# EAGLE design six4mix (EAGLE 6.6.0)
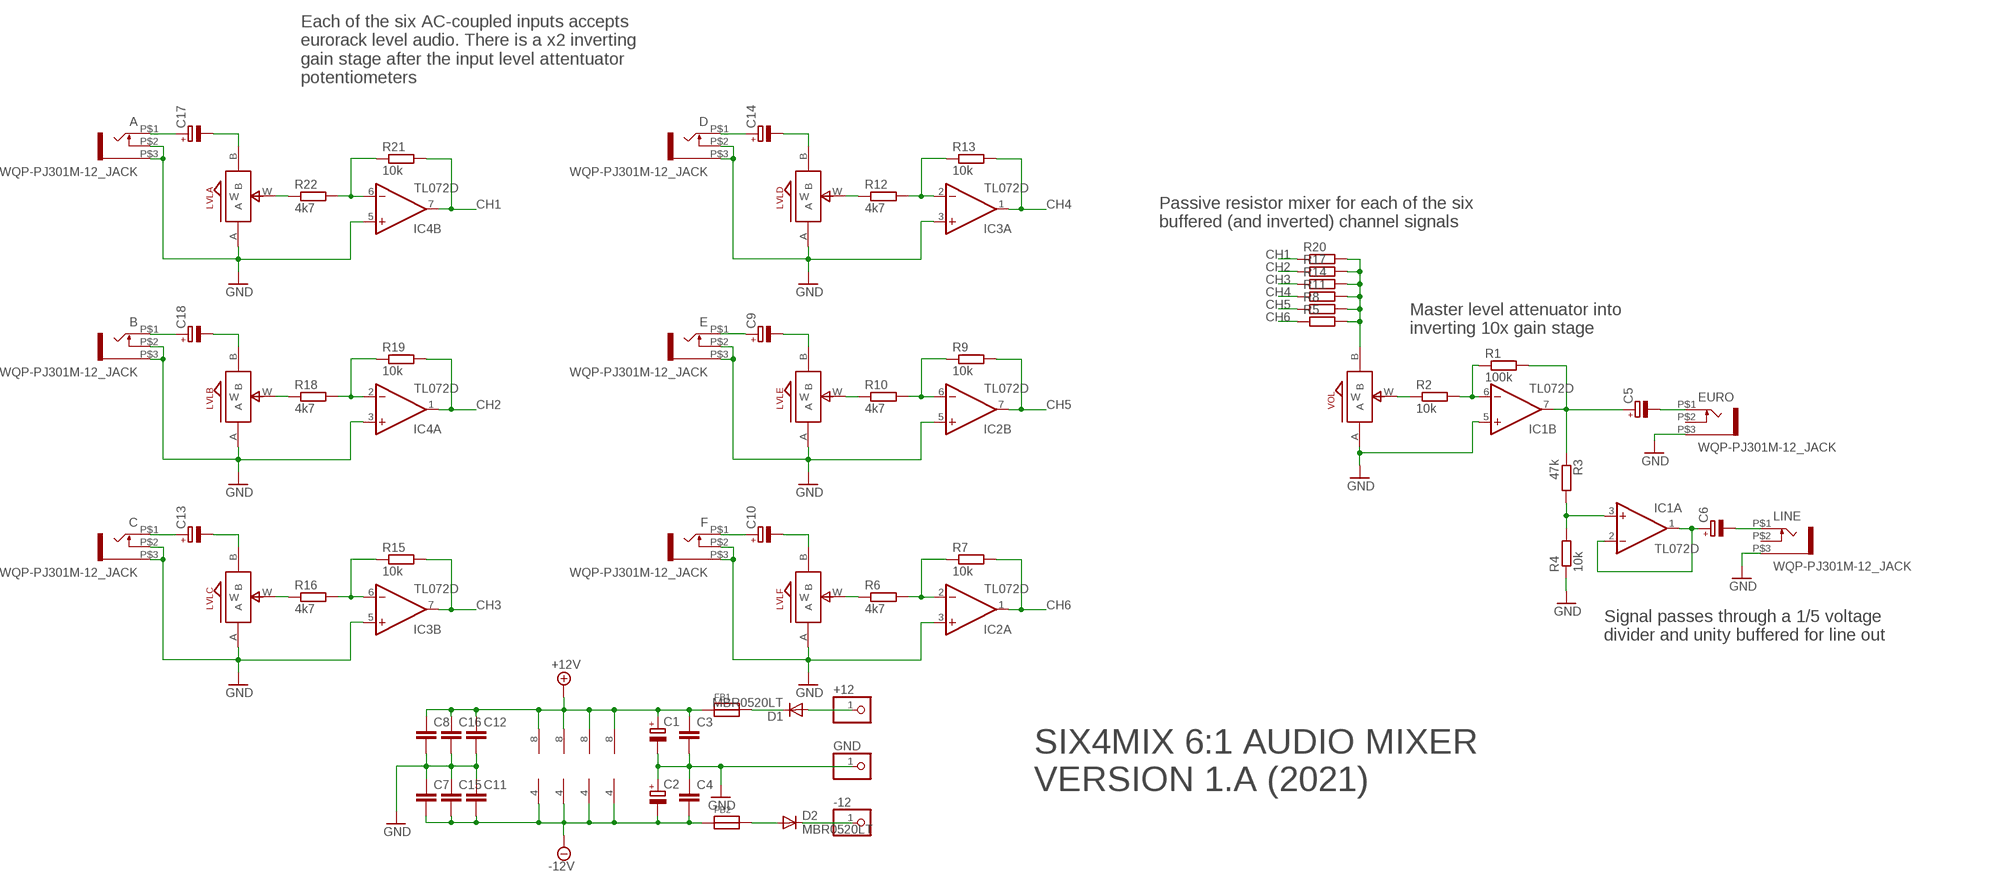
[diagram p0: schematic, sheet 1]

## Parts
+12  PINHD-1X1  [1X01]
-12  PINHD-1X1  [1X01]
A  WQP-PJ301M-12_JACK  [WQP-PJ301M-12_JACK]
B  WQP-PJ301M-12_JACK  [WQP-PJ301M-12_JACK]
C  WQP-PJ301M-12_JACK  [WQP-PJ301M-12_JACK]
C1  CPOL-EUE2-4  [E2-4]
C2  CPOL-EUE2-4  [E2-4]
C3  C-EUC0805  [C0805]
C4  C-EUC0805  [C0805]
C5  CPOL-EUE2-4  [E2-4]
C6  CPOL-EUE2-4  [E2-4]
C7  C-EUC0805  [C0805]
C8  C-EUC0805  [C0805]
C9  CPOL-EUE2-4  [E2-4]
C10  CPOL-EUE2-4  [E2-4]
C11  C-EUC0805  [C0805]
C12  C-EUC0805  [C0805]
C13  CPOL-EUE2-4  [E2-4]
C14  CPOL-EUE2-4  [E2-4]
C15  C-EUC0805  [C0805]
C16  C-EUC0805  [C0805]
C17  CPOL-EUE2-4  [E2-4]
C18  CPOL-EUE2-4  [E2-4]
D  WQP-PJ301M-12_JACK  [WQP-PJ301M-12_JACK]
D1  MBR0520LT  [SOD123]
D2  MBR0520LT  [SOD123]
E  WQP-PJ301M-12_JACK  [WQP-PJ301M-12_JACK]
EURO  WQP-PJ301M-12_JACK  [WQP-PJ301M-12_JACK]
F  WQP-PJ301M-12_JACK  [WQP-PJ301M-12_JACK]
FB1  FERRITE  [0603]
FB2  FERRITE  [0603]
GND  PINHD-1X1  [1X01]
IC1  TL072D  [SO08]
IC2  TL072D  [SO08]
IC3  TL072D  [SO08]
IC4  TL072D  [SO08]
LINE  WQP-PJ301M-12_JACK  [WQP-PJ301M-12_JACK]
LVLA  ALPS_POT_SMALL  [SMALL_ALPS_POT]
LVLB  ALPS_POT_SMALL  [SMALL_ALPS_POT]
LVLC  ALPS_POT_SMALL  [SMALL_ALPS_POT]
LVLD  ALPS_POT_SMALL  [SMALL_ALPS_POT]
LVLE  ALPS_POT_SMALL  [SMALL_ALPS_POT]
LVLF  ALPS_POT_SMALL  [SMALL_ALPS_POT]
R1  100k  R-EU_R0805  [R0805]
R2  10k  R-EU_R0805  [R0805]
R3  47k  R-EU_R0805  [R0805]
R4  10k  R-EU_R0805  [R0805]
R5  R-EU_R0805  [R0805]
R6  4k7  R-EU_R0805  [R0805]
R7  10k  R-EU_R0805  [R0805]
R8  R-EU_R0805  [R0805]
R9  10k  R-EU_R0805  [R0805]
R10  4k7  R-EU_R0805  [R0805]
R11  R-EU_R0805  [R0805]
R12  4k7  R-EU_R0805  [R0805]
R13  10k  R-EU_R0805  [R0805]
R14  R-EU_R0805  [R0805]
R15  10k  R-EU_R0805  [R0805]
R16  4k7  R-EU_R0805  [R0805]
R17  R-EU_R0805  [R0805]
R18  4k7  R-EU_R0805  [R0805]
R19  10k  R-EU_R0805  [R0805]
R20  R-EU_R0805  [R0805]
R21  10k  R-EU_R0805  [R0805]
R22  4k7  R-EU_R0805  [R0805]
VOL  ALPS_POT_SMALL  [SMALL_ALPS_POT]

## Nets
+12V: C1.+ C3.1 C8.1 C12.1 C16.1 FB1.1 IC1.8(P:V+) IC2.8(P:V+) IC3.8(P:V+) IC4.8(P:V+)
-12V: C2.- C4.2 C7.2 C11.2 C15.2 FB2.1 IC1.4(P:V-) IC2.4(P:V-) IC3.4(P:V-) IC4.4(P:V-)
CH1: IC4.7(B:OUT) R20.1 R21.2
CH2: IC4.1(A:OUT) R17.1 R19.2
CH3: IC3.7(B:OUT) R14.1 R15.2
CH4: IC3.1(A:OUT) R11.1 R13.2
CH5: IC2.7(B:OUT) R8.1 R9.2
CH6: IC2.1(A:OUT) R5.1 R7.2
GND: A.P$2 A.P$3 B.P$2 B.P$3 C1.- C2.+ C3.2 C4.1 C7.1 C8.2 C11.1 C12.2 C15.1 C16.2 C.P$2 C.P$3 D.P$2 D.P$3 E.P$2 E.P$3 EURO.P$3 F.P$2 F.P$3 GND.1 IC1.5(B:+IN) IC2.3(A:+IN) IC2.5(B:+IN) IC3.3(A:+IN) IC3.5(B:+IN) IC4.3(A:+IN) IC4.5(B:+IN) LINE.P$3 LVLA.A LVLB.A LVLC.A LVLD.A LVLE.A LVLF.A R4.1 VOL.A
N$1: C9.+ E.P$1
N$2: C9.- LVLE.B
N$3: IC2.6(B:-IN) R9.1 R10.2
N$4: LVLE.W R10.1
N$5: C10.+ F.P$1
N$6: C10.- LVLF.B
N$7: IC2.2(A:-IN) R6.2 R7.1
N$8: LVLF.W R6.1
N$9: C13.+ C.P$1
N$10: C13.- LVLC.B
N$11: IC3.6(B:-IN) R15.1 R16.2
N$12: LVLC.W R16.1
N$13: C14.+ D.P$1
N$14: C14.- LVLD.B
N$15: IC3.2(A:-IN) R12.2 R13.1
N$16: LVLD.W R12.1
N$17: A.P$1 C17.+
N$18: C17.- LVLA.B
N$19: IC4.6(B:-IN) R21.1 R22.2
N$20: LVLA.W R22.1
N$21: B.P$1 C18.+
N$22: C18.- LVLB.B
N$23: IC4.2(A:-IN) R18.2 R19.1
N$24: LVLB.W R18.1
N$25: R5.2 R8.2 R11.2 R14.2 R17.2 R20.2 VOL.B
N$26: C5.- EURO.P$1
N$27: C6.- LINE.P$1
N$28: R2.1 VOL.W
N$29: IC1.6(B:-IN) R1.1 R2.2
N$30: C5.+ IC1.7(B:OUT) R1.2 R3.1
N$31: D1.C FB1.2
N$32: C6.+ IC1.1(A:OUT) IC1.2(A:-IN)
N$33: IC1.3(A:+IN) R3.2 R4.2
N$34: +12.1 D1.A
N$35: D2.A FB2.2
N$36: -12.1 D2.C
Unconnected: EURO.P$2 LINE.P$2

## Notes on the sheet
- Each of the six AC-coupled inputs accepts 
  eurorack level audio. There is a x2 inverting
  gain stage after the input level attentuator 
  potentiometers
- Passive resistor mixer for each of the six
  buffered (and inverted) channel signals
- Master level attenuator into 
  inverting 10x gain stage
- Signal passes through a 1/5 voltage 
  divider and unity buffered for line out
- SIX4MIX 6:1 AUDIO MIXER
  VERSION 1.A (2021)

## Library data of the parts
+12 -12 GND = pinhead:PINHD-1X1: PIN HEADER
A B C D E EURO F LINE = thonkiconn:WQP-PJ301M-12_JACK
C1 C2 C5 C6 C9 C10 C13 C14 C17 C18 = resistor:CPOL-EU: POLARIZED CAPACITOR, European symbol
C3 C4 C7 C8 C11 C12 C15 C16 = rcl:C-EU: CAPACITOR, European symbol
D1 D2 = diode:MBR0520LT: SCHOTTKY BARRIER RECTIFIER Source: http://onsemi.com .. MBR0520LT1-D.pdf
FB1 FB2 = microbuilder:FERRITE: Ferrite Bead 0603 MMZ1608B121C - 120 Ohm, 600mA Ferrite Chip - Digikey: 445-2164-1-ND BK1608HW121-T - 120 Ohm, 600mA Ferrite Chip - Digikey: 587-1876-2-ND
IC1-IC4 = linear:TL072: OP AMP
LVLA LVLB LVLC LVLD LVLE LVLF VOL = jasons_stuff:ALPS_POT_SMALL
R1-R22 = rcl:R-EU_: RESISTOR, European symbol

## Board
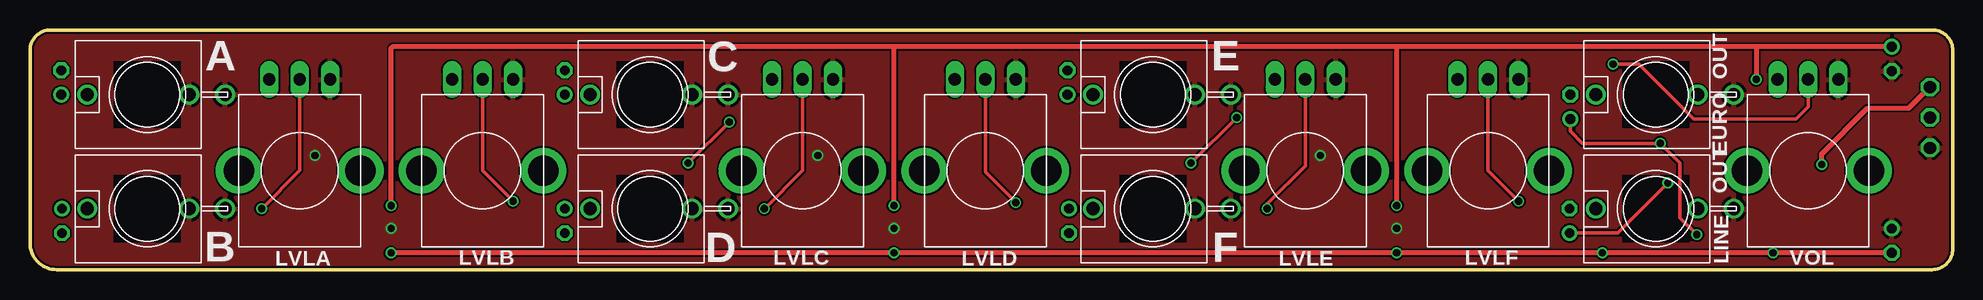
[diagram p1: board, top side]
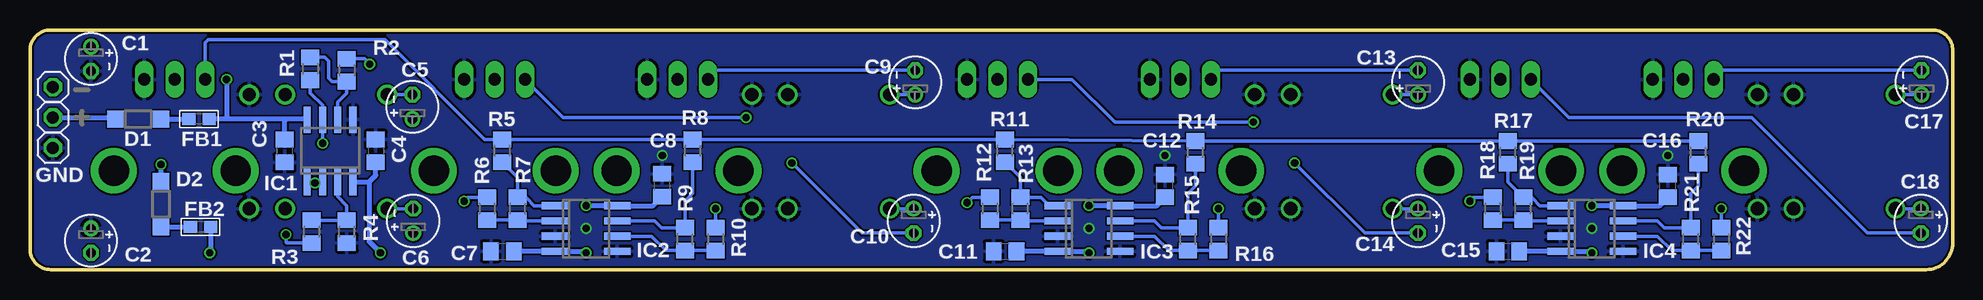
[diagram p2: board, bottom side, seen from below]

Size 160.27 x 20 mm. Coordinates in mm from the lower left corner, seen from the top.
Outline: 160.27,18.29 arc90 158.56,20 1.72,20 arc90 0,18.29 0,2.22 arc90 2.22,0 158.56,0 arc90 160.27,1.71
Outline: 160.27,18.35 160.27,1.78
Copper layers (1*16): Top 0.035mm / dielectric 1.5mm / Bottom 0.035mm
Design rules "hackvana": minimum track width 6mil, minimum drill 0.3mm, track to track 6mil, track to pad 9mil, pad to pad 6mil, via to via 6mil, smd to smd 0mil, copper to edge 6mil, drill to drill 6mil, minimum pad ring 10mil, minimum via ring 6mil, stop-mask expansion 2mil, vias tented up to drill 100mil, thermal gap 10mil

### Footprints (pad centres in the part's own frame; a part is rotated, then mirrored left to right if it is on the bottom)
1X01 = drill 1.016 octagon: 1 0,0
WQP-PJ301M-12_JACK = drill 1.1: P$1 0,5; P$2 0,-3.5; P$3 0,-6.5
E2-4 = drill 0.813 pad 1.27: + -1.016,0 | drill 0.813 pad 1.27 octagon: - 1.016,0
C0805 = smd 1.3 x 1.5: 1 -0.95,0; 2 0.95,0
SOD123 = smd 1.4 x 1.4: A 1.9,0; C -1.9,0
0603 = smd 1.1 x 1: 1 -0.85,0; 2 0.85,0
SO08 = smd 0.6 x 2.2: 1 -1.905,-2.6; 2 -0.635,-2.6; 3 0.635,-2.6; 4 1.905,-2.6; 5 1.905,2.6; 6 0.635,2.6; 7 -0.635,2.6; 8 -1.905,2.6
SMALL_ALPS_POT = drill 1.016 long: A -2.54,-7.62; B 2.54,-7.62; W 0,-7.62 | drill 2.54 pad 3.81: GND@1 -5.08,0; GND@2 5.08,0
R0805 = smd 1.3 x 1.5: 1 -0.95,0; 2 0.95,0

### Placement (x,y rotation side)
+12  158.37,12.7 0 bottom
-12  158.37,15.24 0 bottom
A  9.78,14.61 90 top
B  9.78,5.08 90 top
C  51.69,14.61 90 top
C1  155.19,17.59 270 bottom
C2  155.19,2.41 270 bottom
C3  139.06,9.91 270 bottom
C4  131.44,9.91 270 bottom
C5  128.4,13.59 90 bottom
C6  128.33,4.06 90 bottom
C7  120.9,1.52 0 bottom
C8  107.57,7.05 90 bottom
C9  86.49,15.62 90 bottom
C10  86.61,4.06 270 bottom
C11  78.99,1.52 0 bottom
C12  65.66,6.99 90 bottom
C13  44.58,15.62 90 bottom
C14  44.58,4.06 270 bottom
C15  37.08,1.52 0 bottom
C16  23.75,6.99 90 bottom
C17  2.6,15.62 90 bottom
C18  2.67,4.06 270 bottom
D  51.69,5.08 90 top
D1  151.26,12.57 180 bottom
D2  149.35,5.46 270 bottom
E  93.6,14.61 90 top
EURO  135.51,14.61 90 top
F  93.6,5.08 90 top
FB1  146.18,12.57 180 bottom
FB2  146.05,3.56 180 bottom
GND  158.37,10.16 0 bottom
IC1  135.25,9.91 0 bottom
IC2  113.92,3.43 270 bottom
IC3  72.01,3.43 270 bottom
IC4  30.1,3.43 270 bottom
LINE  135.51,5.08 90 top
LVLA  22.48,8.26 180 top
LVLB  37.72,8.26 180 top
LVLC  64.39,8.26 180 top
LVLD  79.63,8.26 180 top
LVLE  106.3,8.26 180 top
LVLF  121.54,8.26 180 top
R1  136.91,16.76 270 bottom
R2  133.86,16.64 270 bottom
R3  136.78,3.17 90 bottom
R4  133.86,3.17 90 bottom
R5  120.9,9.91 90 bottom
R6  122.17,5.08 270 bottom
R7  119.63,5.08 90 bottom
R8  105.03,9.91 90 bottom
R9  105.66,2.54 90 bottom
R10  103.12,2.54 270 bottom
R11  78.99,9.91 90 bottom
R12  80.26,5.08 270 bottom
R13  77.72,5.08 90 bottom
R14  63.12,9.78 90 bottom
R15  63.75,2.54 90 bottom
R16  61.21,2.54 270 bottom
R17  37.08,9.78 90 bottom
R18  38.35,5.08 270 bottom
R19  35.81,5.08 90 bottom
R20  21.21,9.78 90 bottom
R21  21.84,2.54 90 bottom
R22  19.3,2.54 270 bottom
VOL  148.21,8.26 180 top

### Tracks (layer width: path | path; a pad name or v marks a point on that pad's centre or on a via)
+12V  (via drill 0.6)
  Top 0.406: C1.+ 143.89,18.61 | 143.89,18.61 113.92,18.61 | 113.92,18.61 71.88,18.61 | 71.88,18.61 30.23,18.61 30.1,18.48 v30.1,5.33 | v72.01,5.33 72.01,18.48 71.88,18.61 | v113.92,5.33 113.92,18.61 | 143.89,18.61 v143.89,15.88
  Bottom 0.406: v72.01,5.33 IC3.8 66.36,5.33 C12.1 | v30.1,5.33 IC4.8 24.45,5.33 C16.1 | v113.92,5.33 IC2.8 108.33,5.33 C8.1 | 145.16,12.7 FB1.1 144.02,12.57 | IC1.8 137.23,12.57 138.94,12.57 | 138.94,12.57 144.02,12.57 | C3.1 139.06,12.45 138.94,12.57 | v143.89,15.88 143.89,12.7 144.02,12.57
-12V  (via drill 0.6)
  Top 0.406: C2.- v145.29,1.4 v131.06,1.4 v113.92,1.4 v72.01,1.4 v30.1,1.4
  Bottom 0.406: v30.1,1.4 30.23,1.52 IC4.4 C15.2 | v72.01,1.4 72.26,1.52 IC3.4 C11.2 | v113.92,1.4 114.17,1.52 IC2.4 C7.2 | FB2.1 145.2,1.49 v145.29,1.4 | IC1.4 132.01,7.31 | 132.01,7.31 131.44,7.87 C4.2 | 132.01,7.31 132.01,2.35 v131.06,1.4
CH1
  Bottom 0.305: R20.1 21.21,6.99 21.84,6.35 R21.2 24.06,3.49 24.64,4.06 IC4.7
CH2
  Bottom 0.305: IC4.1 34.42,5.33 35.05,5.97 35.75,5.97 R19.2 37.08,7.3 R17.1
CH3
  Bottom 0.305: IC3.7 66.55,4.06 65.97,3.49 R15.2 63.75,6.35 63.12,6.99 R14.1
CH4
  Bottom 0.305: IC3.1 75.31,5.33 76.01,6.03 R13.2 77.72,7.69 R11.1
CH5
  Bottom 0.305: IC2.7 108.2,4.06 107.63,3.49 R9.2 105.66,5.71 105.03,6.35 R8.1
CH6
  Bottom 0.305: IC2.1 118.24,5.33 118.87,5.97 119.57,5.97 R7.2 119.63,7.69 R5.1
GND  (via drill 0.6)
  other vias: 30.1,3.43 23.75,9.53 72.01,3.43 65.66,9.53 107.57,9.53 113.92,3.43
  pour Bottom: -2.29,25.4 -2.29,-5.08 165.35,-5.08 165.35,25.4
  pour Top: -2.29,22.86 -2.29,-2.54 162.81,-2.54 162.81,22.86
N$1
  Bottom 0.305: C9.+ E.P$1
N$2
  Bottom 0.305: C9.- 103,16.64 LVLE.B
N$3
  Bottom 0.305: IC2.6 108.46,2.79 107.25,1.59 R9.1 R10.2
N$4  (via drill 0.6)
  Top 0.305: v103.12,5.08 103.12,5.46 106.3,8.64 LVLE.W
  Bottom 0.305: R10.1 v103.12,5.08
N$5
  Bottom 0.305: F.P$1 C10.+
N$6  (via drill 0.6)
  Top 0.305: v96.77,8.89 v100.58,12.7
  Bottom 0.305: C10.- 90.93,3.05 v96.77,8.89 | LVLF.B 115.82,12.7 103.12,12.7 v100.58,12.7
N$7
  Bottom 0.305: IC2.2 119.57,4.06 R7.1 R6.2
N$8  (via drill 0.6)
  Top 0.305: LVLF.W 121.54,8.26 v124.08,5.71
  Bottom 0.305: R6.1 123.76,6.03 v124.08,5.71
N$9
  Bottom 0.305: C.P$1 C13.+
N$10
  Bottom 0.305: C13.- 61.09,16.64 LVLC.B
N$11
  Bottom 0.305: R16.2 R15.1 65.34,1.59 66.55,2.79 IC3.6
N$12  (via drill 0.6)
  Top 0.305: v61.21,5.08 64.39,8.26 LVLC.W
  Bottom 0.305: R16.1 v61.21,5.08
N$13
  Bottom 0.305: D.P$1 C14.+
N$14  (via drill 0.6)
  Top 0.305: v58.29,12.32 v54.86,8.89
  Bottom 0.305: C14.- 49.02,3.05 v54.86,8.89 | v58.29,12.32 69.85,12.32 73.41,15.88 LVLD.B
N$15
  Bottom 0.305: IC3.2 77.66,4.06 R13.1 R12.2
N$16  (via drill 0.6)
  Top 0.305: v82.17,5.59 79.63,8.13 LVLD.W
  Bottom 0.305: R12.1 81.73,6.03 v82.17,5.59
N$17
  Bottom 0.305: C17.+ A.P$1
N$18
  Bottom 0.305: C17.- 19.18,16.64 LVLA.B
N$19
  Bottom 0.305: IC4.6 24.64,2.79 23.43,1.59 R21.1 R22.2
N$20  (via drill 0.6)
  Top 0.305: v19.3,5.08 22.48,8.26 LVLA.W
  Bottom 0.305: R22.1 v19.3,5.08
N$21
  Bottom 0.305: C18.+ B.P$1
N$22
  Bottom 0.305: C18.- 7.11,3.05 16.76,12.7 32,12.7 LVLB.B
N$23
  Bottom 0.305: IC4.2 35.75,4.06 R19.1 R18.2
N$24  (via drill 0.6)
  Top 0.305: v40.26,5.71 37.72,8.26 LVLB.W
  Bottom 0.305: R18.1 39.94,6.03 v40.26,5.71
N$25
  Bottom 0.305: R20.2 R17.2 R14.2 R11.2 R8.2 R5.2 122.36,10.86 130.68,19.18 145.41,19.18 145.67,18.92 VOL.B
N$26
  Bottom 0.305: EURO.P$1 C5.-
N$27
  Bottom 0.305: LINE.P$1 C6.-
N$28  (via drill 0.6)
  Top 0.305: v131.95,17.14 134.11,17.14 138.68,12.57 147.19,12.57 148.21,13.59 VOL.W
  Bottom 0.305: R2.1 132.4,17.59 v131.95,17.14
N$29
  Bottom 0.305: IC1.6 134.62,13.97 133.86,14.73 R2.2 135.07,15.69 135.38,16 135.38,17.4 135.7,17.71 R1.1
N$30  (via drill 0.6)
  Top 0.305: C5.+ 128.4,11.56 129.41,10.54 v135.89,10.54 137.54,8.89 137.54,4.32 v138.94,2.92
  Bottom 0.305: R1.2 136.91,14.73 135.89,13.72 IC1.7 v135.89,10.54 | R3.1 138.88,2.23 138.94,2.29 v138.94,2.92
N$31
  Bottom 0.406: D1.C FB1.2
N$32  (via drill 0.6)
  Top 0.305: C6.+ 132.33,3.05 v136.53,7.24
  Bottom 0.305: IC1.1 IC1.2 136.46,7.31 v136.53,7.24
N$33
  Bottom 0.305: IC1.3 134.62,6.1 133.86,5.33 R4.2 R3.2
N$34
  Bottom 0.406: +12.1 153.28,12.7 D1.A
N$35
  Bottom 0.406: D2.A FB2.2
N$36  (via drill 0.6)
  Top 0.406: v149.35,8.76 149.35,9.65 153.16,13.46 156.59,13.46 -12.1
  Bottom 0.406: D2.C v149.35,8.76

### Text on the board
tNames: OUT | OUT
bDocu: sixty four pixels ltd/2022 | six4mix 6:1 audio v1